# Altium project cu_v4_butons.PrjPCB
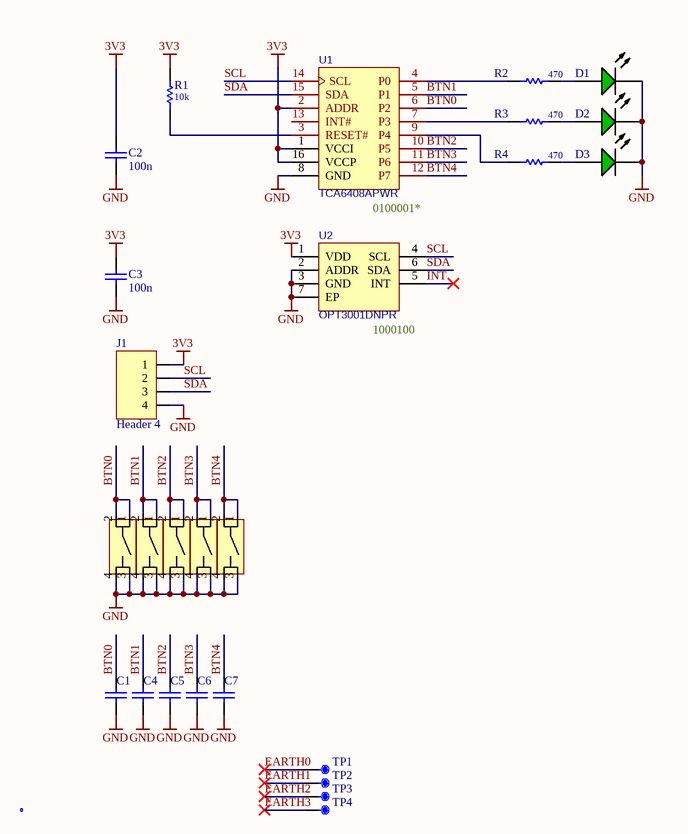
[diagram p0: schematic.SchDoc]
PRJ_ID: CU Buttons; PRJ_VER: v1.0.0
1 sheet, 27 parts. Net scope: global (net labels, ports and power ports of the same name join across sheets).
Board file: board.PcbDoc

## Sheet schematic.SchDoc: Display & buttons board
size A4; Revision: 1; SheetNumber: 6; SheetTotal: 29

### Parts
C1  100n  [C0402]  (value not drawn)
C2  100n  [C0402]
C3  100n  [C0402]
C4  100n  [C0402]  (value not drawn)
C5  100n  [C0402]  (value not drawn)
C6  100n  [C0402]  (value not drawn)
C7  100n  [C0402]  (value not drawn)
D1  GRN  [LED-0603-GRN]  (value not drawn)
D2  GRN  [LED-0603-GRN]  (value not drawn)
D3  GRN  [LED-0603-GRN]  (value not drawn)
J1  Header 4  [HDR-1x4-P1.25]  (no BOM)
LOGO1  LOGO  [LOGO]  (value not drawn)  (no BOM)
R1  10k  [R0402]
R2  470  [R0402]
R3  470  [R0402]
R4  470  [R0402]
SW1  TS-1187A-B-A-B  [SW-SMD_4P-L5.1-W5.1-P3.70-LS6.5-TL-2]  (value not drawn)
SW2  TS-1187A-B-A-B  [SW-SMD_4P-L5.1-W5.1-P3.70-LS6.5-TL-2]  (value not drawn)
SW3  TS-1187A-B-A-B  [SW-SMD_4P-L5.1-W5.1-P3.70-LS6.5-TL-2]  (value not drawn)
SW4  TS-1187A-B-A-B  [SW-SMD_4P-L5.1-W5.1-P3.70-LS6.5-TL-2]  (value not drawn)
SW5  TS-1187A-B-A-B  [SW-SMD_4P-L5.1-W5.1-P3.70-LS6.5-TL-2]  (value not drawn)
TP1  (no value)  [TP30_SMD]  (no BOM)
TP2  (no value)  [TP30_SMD]  (no BOM)
TP3  (no value)  [TP30_SMD]  (no BOM)
TP4  (no value)  [TP30_SMD]  (no BOM)
U1  TCA6408APWR  [TSSOP-16]
U2  OPT3001DNPR  [USON6_L2.1-W2.1-P0.65-BL-EP]

### Nets
3V3: C2.2 C3.2 J1.1 R1.2 U1.1(VCCI) U1.2(ADDR) U1.16(VCCP) U2.1(VDD)
GND: C1.1 C2.1 C3.1 C4.1 C5.1 C6.1 C7.1 D1.2(K) D2.2(K) D3.2(K) J1.4 SW1.3 SW1.4 SW2.3 SW2.4 SW3.3 SW3.4 SW4.3 SW4.4 SW5.3 SW5.4 U1.8(GND) U2.2(ADDR) U2.3(GND) U2.7(EP)
BTN0: C1.2 SW1.1 SW1.2 U1.6(P2)
BTN1: C4.2 SW2.1 SW2.2 U1.5(P1)
BTN2: C5.2 SW3.1 SW3.2 U1.10(P5)
BTN3: C6.2 SW4.1 SW4.2 U1.11(P6)
BTN4: C7.2 SW5.1 SW5.2 U1.12(P7)
EARTH0: TP1.1
EARTH1: TP2.1
EARTH2: TP3.1
EARTH3: TP4.1
INT: U2.5(INT)
SCL: J1.2 U1.14(SCL) U2.4(SCL)
SDA: J1.3 U1.15(SDA) U2.6(SDA)
NetD1_1: D1.1(A) R2.2
NetD2_1: D2.1(A) R3.2
NetD3_1: D3.1(A) R4.2
NetR1_1: R1.1 U1.3(RESET#)
NetR2_1: R2.1 U1.4(P0)
NetR3_1: R3.1 U1.7(P3)
NetR4_1: R4.1 U1.9(P4)

Not connected (* = marked no-connect by the designer): U1 13(INT#)

### Notes on the sheet
- 0100001*
- (near U2) 1000100

### Library data of the parts
C1-C7 = Cap
D1-D3 = LED-0603-GREEN: LED 0603 GRN; P/N: SZYY0603G; LCSC part number: C434420
J1 = Header 3: LCSC part number: -; P/N: -
R1 = RES_0402_1K5-1%
R2-R4 = RES_0402_220R-1%: P/N: RC0402FR-07220RL; LCSC part number: C112291
SW1-SW5 = Component_1: LCSC part number: C318884; P/N: TS-1187A-B-A-B
TP1-TP4 = TP_Dup1: LCSC part number: -; P/N: -
U1 = TCA6408APWR: LCSC part number: C206177; P/N: TCA6408APWR
U2 = OPT3001DNPR: LCSC part number: C90462; P/N: OPT3001DNPR